# EAGLE design ble121lr_dongle_v21 (EAGLE 7.7.0)
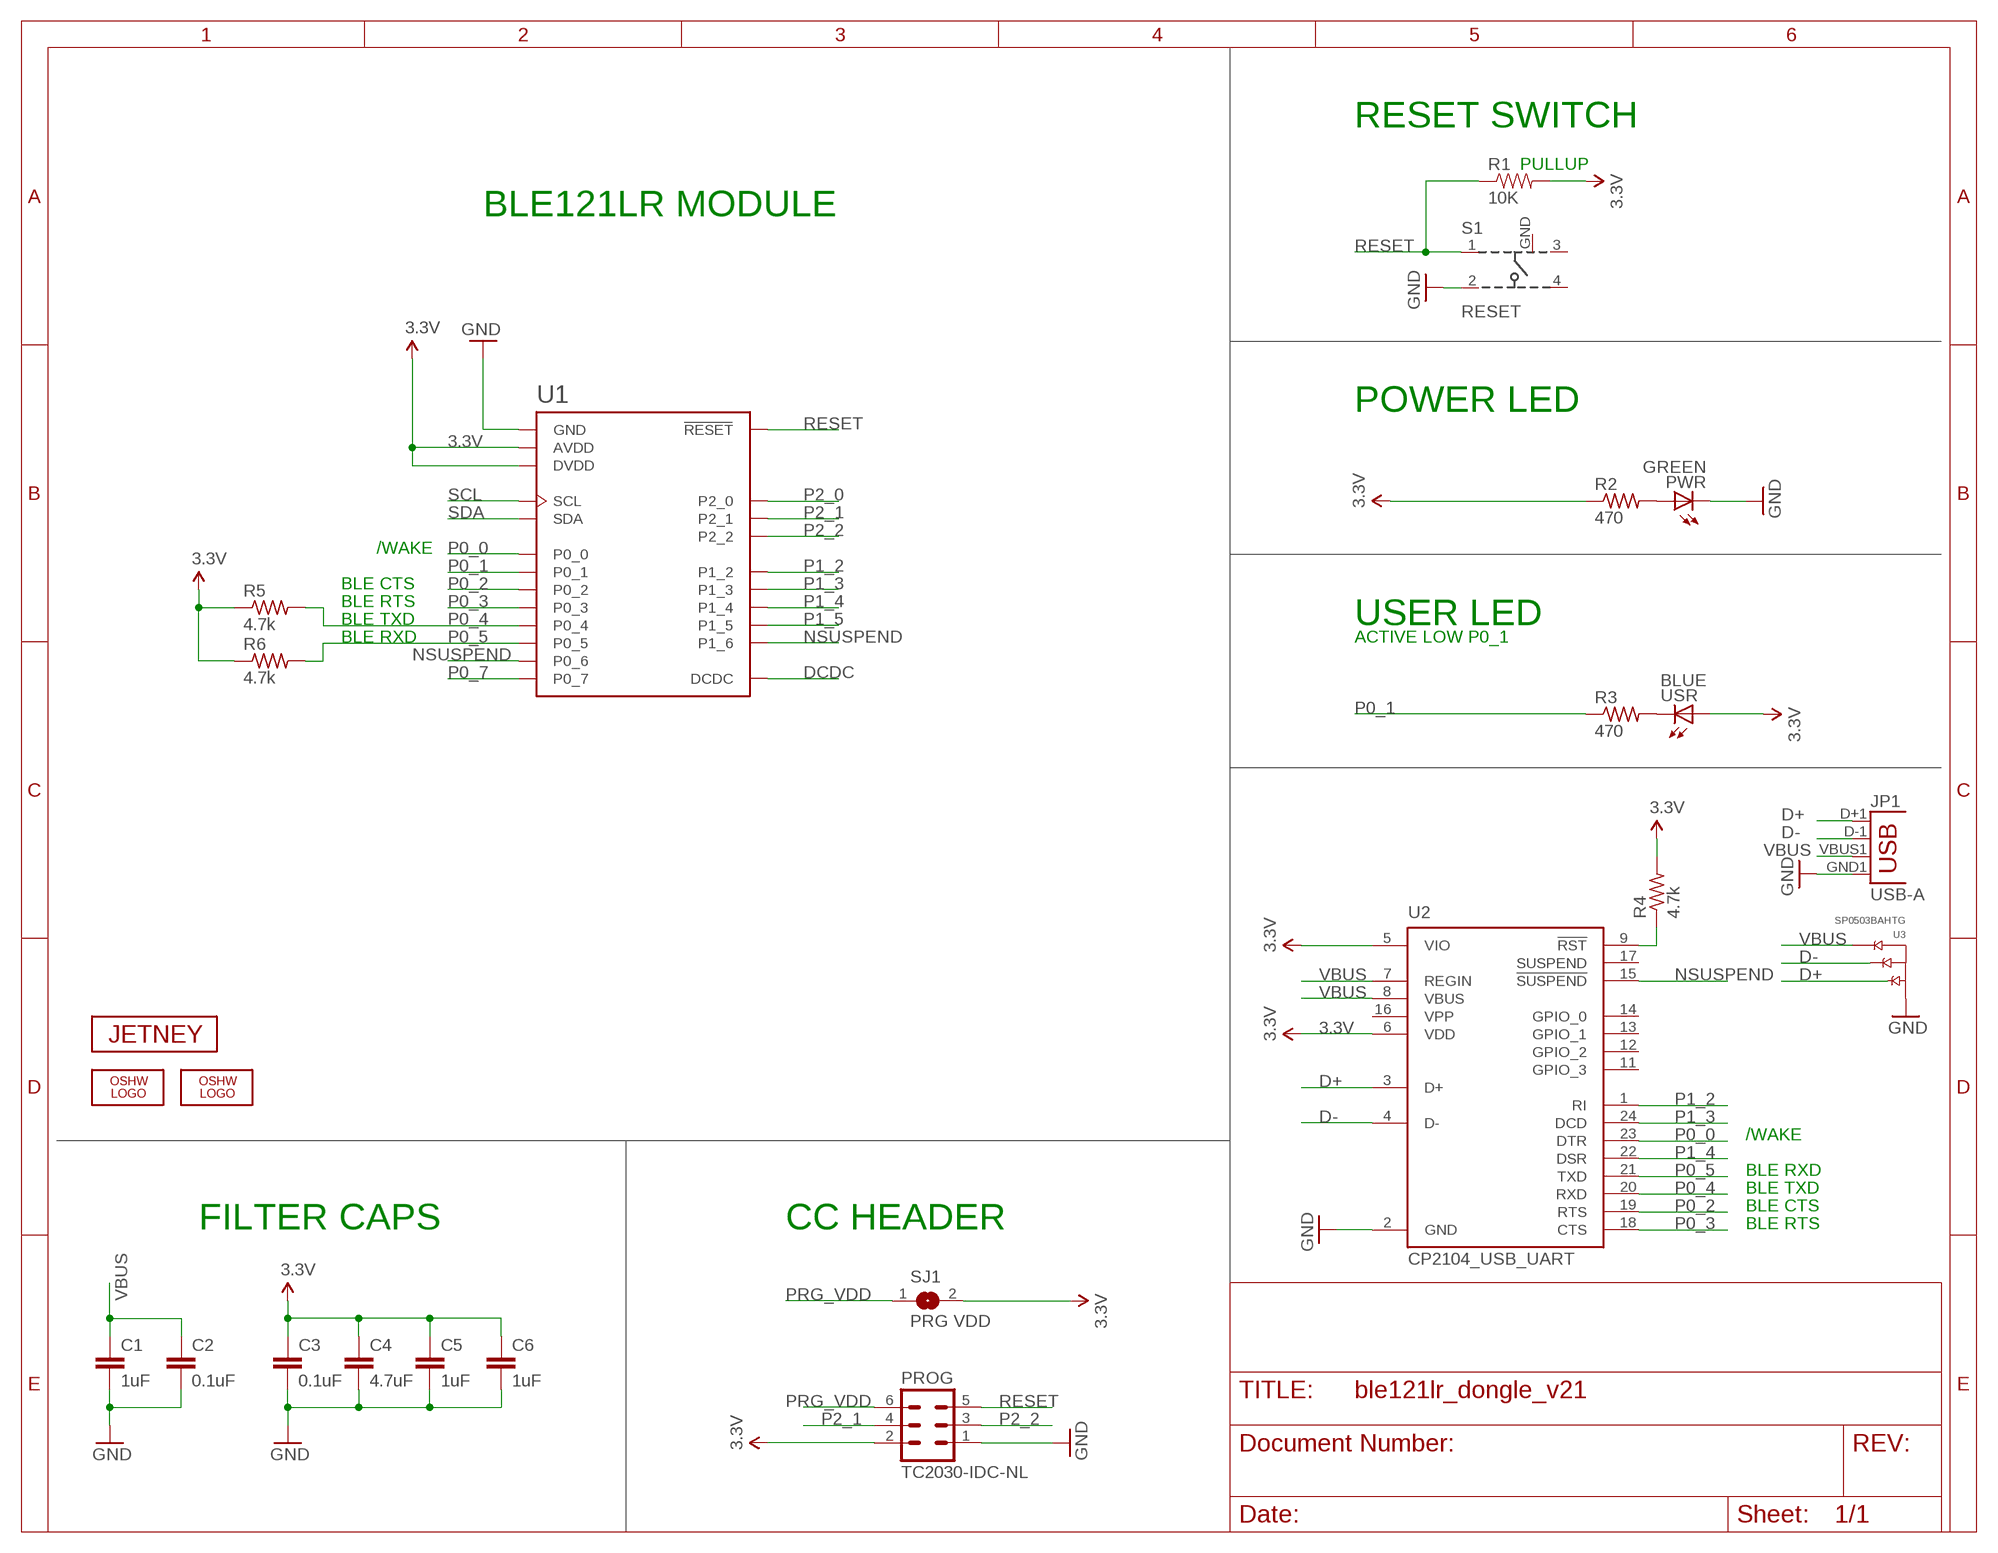
[diagram p0: schematic, sheet 1]

## Parts
C1  1uF  CAP0603-CAP  [0603-CAP]
C2  0.1uF  CAP0603-CAP  [0603-CAP]
C3  0.1uF  CAP0603-CAP  [0603-CAP]
C4  4.7uF  CAP0603-CAP  [0603-CAP]
C5  1uF  CAP0603-CAP  [0603-CAP]
C6  1uF  CAP0603-CAP  [0603-CAP]
JP1  USB-A  USBA-SMD-MALE-MOLEX  [USB-A-SMT-MALE-MOLEX]
LOGO1  OSHW_LOGO_FILLX0100-NT  [OSHW_FILLX100_NOTEXT]
LOGO2  OSHW_LOGO_FILLX0070-NT  [OSHW_FILLX70_NOTEXT]
PROG  TC2030-IDC-NL  [TC2030-IDC-NL]
PWR  GREEN  LEDCHIPLED_0805  [CHIPLED_0805]
R1  10K  RESISTOR0603-RES  [0603-RES]
R2  470  R-US_R0603  [R0603]
R3  470  R-US_R0603  [R0603]
R4  4.7k  R-US_R0603  [R0603]
R5  4.7k  R-US_R0603  [R0603]
R6  4.7k  R-US_R0603  [R0603]
S1  RESET  101-IG  [101-IG]
SJ1  PRG VDD  SJ  [SJ]
U1  BLE121LR-A  [BLE121LR-A]
U2  CP2104_USB_UART  [QFN-24_ALT1.PAC]
U3  SP0503BAHTG  [SOT143]
U$2  JETNEY-LOGO-12  [JETNEY-LOGO-12]
USR  BLUE  LEDCHIPLED_0805  [CHIPLED_0805]

## Nets
3.3V [power]: C3.1 C4.1 C5.1 C6.1 PROG.2 R1.2 R2.1 R4.2 R5.1 R6.1 SJ1.2 U1.AVDD U1.DVDD U2.5(VIO) U2.6(VDD) USR.A
D+: JP1.D+1(D+) U2.3(D+) U3.2(A)
D-: JP1.D-1(D-) U2.4(D-) U3.3(B)
DCDC: U1.DCDC
GND [power]: C1.2 C2.2 C3.2 C4.2 C5.2 C6.2 JP1.GND1(GND) PROG.1 PWR.C S1.2 U1.GND U1.GND@2(GND) U1.GND@3(GND) U1.GND@4(GND) U1.GND@5(GND) U1.GND@6(GND) U1.GND@7(GND) U1.GND@8(GND) U1.GND@9(GND) U1.GND@10(GND) U1.GND@11(GND) U1.GND@12(GND) U1.GND@13(GND) U2.2(GND) U3.1(GND)
N$1: PWR.A R2.2
N$4: R3.2 USR.C
N$6: R4.1 U2.9(!RST)
NSUSPEND: U1.P0_6 U1.P1_6 U2.15(!SUSPEND)
P0_0: U1.P0_0 U2.23(DTR)
P0_1: R3.1 U1.P0_1
P0_2: U1.P0_2 U2.19(RTS)
P0_3: U1.P0_3 U2.18(CTS)
P0_4: R5.2 U1.P0_4 U2.20(RXD)
P0_5: R6.2 U1.P0_5 U2.21(TXD)
P0_7: U1.P0_7
P1_2: U1.P1_2 U2.1(RI)
P1_3: U1.P1_3 U2.24(DCD)
P1_4: U1.P1_4 U2.22(DSR)
P1_5: U1.P1_5
P2_0: U1.P2_0
P2_1: PROG.4 U1.P2_1
P2_2: PROG.3 U1.P2_2
PRG_VDD [power]: PROG.6 SJ1.1
RESET: PROG.5 R1.1 S1.1 U1.RESET
SCL: U1.SCL
SDA: U1.SDA
VBUS: C1.1 C2.1 JP1.VBUS1(VBUS) U2.7(REGIN) U2.8(VBUS) U3.4(C)
Unconnected: S1.3 S1.4 U2.11(GPIO_3) U2.12(GPIO_2) U2.13(GPIO_1) U2.14(GPIO_0) U2.17(SUSPEND)

## Notes on the sheet
- RESET SWITCH
- PULLUP
- BLE121LR MODULE
- POWER LED
- /WAKE
- BLE CTS
- BLE RTS
- BLE TXD | USER LED
- BLE RXD | ACTIVE LOW P0_1
- /WAKE
- BLE RXD
- BLE TXD
- BLE CTS
- FILTER CAPS | CC HEADER | BLE RTS

## Power pins joined to a net without a drawn wire
GND: S1.GND
VPP: U2.16(VPP)

## Library data of the parts
C1-C6 = SparkFun:CAP: Capacitor Standard 0603 ceramic capacitor, and 0.1" leaded capacitor.
JP1 = SparkFun-Connectors:USB: USB Connectors USB-B-PTH is fully proven SKU : PRT-00139/CONN-08278 USB-miniB is fully proven SKU : PRT-00587 USB-A-PCB is untested. USB-A-H is throughly reviewed, but untested. Spark Fun Electronics SKU : PRT-00437 USB-B-SMT is throughly reviewed, but untested. Needs silkscreen touching up. USB-A-S has not been used/tested USB-MB-H has not been used/tested USB-MICROB has been used. CONN-09505
LOGO1 LOGO2 = oshw-logo:OSHW_LOGO_FILL
PROG = TagConnect:TC2030-IDC: Tag-Connect In Circuit Programming & Debug Cable 6 Pin http://www.tag-connect.com
PWR USR = led:LED: LED OSRAM: - CHIPLED LG R971, LG N971, LY N971, LG Q971, LY Q971, LO R971, LY R971 LH N974, LH R974 LS Q976, LO Q976, LY Q976 LO Q996 - Hyper CHIPLED LW Q18S LB Q993, LB Q99A, LB R99A - SideLED LS A670, LO A670, LY A670, LG A670, LP A670 LB A673, LV A673, LT A673, LW A673 LH A674 LY A675 LS A676, LA A676, LO A676, LY A676, LW A676 LS A679, LY A679, LG A679 - Hyper Micro SIDELED® LS Y876, LA Y876, LO Y876, LY Y876 LT Y87S - SmartLED LW L88C, LW L88S LB L89C, LB L89S, LG L890 LS L89K, LO L89K, LY L89K LS L896, LA L896, LO L896, LY L896 - TOPLED LS T670, LO T670, LY T670, LG T670, LP T670 LSG T670, LSP T670, LSY T670, LOP T670, LYG T670 LG T671, LOG T671, LSG T671 LB T673, LV T673, LT T673, LW T673 LH T674 LS T676, LA T676, LO T676, LY T676, LB T676, LH T676, LSB T676, LW T676 LB T67C, LV T67C, LT T67C, LS T67K, LO T67K, LY T67K, LW E67C LS E67B, LA E67B, LO E67B, LY E67B, LB E67C, LV E67C, LT E67C LW T67C LS T679, LY T679, LG T679 LS T770, LO T770, LY T770, LG T770, LP T770 LB T773, LV T773, LT T773, LW T773 LH T774 LS E675, LA E675, LY E675, LS T675 LS T776, LA T776, LO T776, LY T776, LB T776 LHGB T686 LT T68C, LB T68C - Hyper Mini TOPLED® LB M676 - Mini TOPLED Santana® LG M470 LS M47K, LO M47K, LY M47K Source: http://www.osram.convergy.de LUXEON: - LUMILED® LXK2-PW12-R00, LXK2-PW12-S00, LXK2-PW14-U00, LXK2-PW14-V00 LXK2-PM12-R00, LXK2-PM12-S00, LXK2-PM14-U00 LXK2-PE12-Q00, LXK2-PE12-R00, LXK2-PE12-S00, LXK2-PE14-T00, LXK2-PE14-U00 LXK2-PB12-K00, LXK2-PB12-L00, LXK2-PB12-M00, LXK2-PB14-N00, LXK2-PB14-P00, LXK2-PB14-Q00 LXK2-PR12-L00, LXK2-PR12-M00, LXK2-PR14-Q00, LXK2-PR14-R00 LXK2-PD12-Q00, LXK2-PD12-R00, LXK2-PD12-S00 LXK2-PH12-R00, LXK2-PH12-S00 LXK2-PL12-P00, LXK2-PL12-Q00, LXK2-PL12-R00 Source: www.luxeon.com KINGBRIGHT: KA-3528ASYC Source: www.kingbright.com
R1 = SparkFun:RESISTOR: Resistor Basic schematic elements and footprints for 0603, 1206, and PTH resistors.
R2-R6 = resistor:R-US_: RESISTOR, American symbol
S1 = sf-keyglove:101-IG
SJ1 = jumper:SJ: SMD solder JUMPER
U1 = sf-bluegiga:BLE121LR: Bluetooth Low Energy single-mode long-range module - Bluetooth 4.0 (CC2541). BLE121LR-A variant has an on-module ceramic chip antenna. BLE121LR-A variant includes keepout/restrict area. Antenna edge of the module should be flush up against the edge of the PCB. See datasheet for variant layout details. IT IS EXTREMELY IMPORTANT THAT YOU FOLLOW THE LAYOUT GUIDELINES FOR THIS MODULE IN ORDER TO ENSURE MAXIMUM RANGE. THIS MEANS THAT YOU NEED A SOLID GROUND PLANE EXTENDING AT LEAST 17 mm ON THE LEFT AND RIGHT SIDES OF THE MODULE, AS SHOWN IN THE DATASHEET. BLE121LR is a Bluetooth Smart Long Range module targeted for Bluetooth Smart applications where the best possible RF performance and range are required. At +8 dBm TX power and -98 dBm sensitivity BLE121LR has best-in-class RF performance and can provide Bluetooth Smart connectivity up to 450 meters. BLE121LR integrates all features required for a Bluetooth Smart application: Bluetooth radio, software stack and GATT based profiles. and it can also host end user applications, which means no external micro controller is required in size, price or power constrained devices. BLE121LR Bluetooth Smart module also has flexible hardware interfaces to connect to different peripherals or sensors. Although BLE121LR Bluetooth Smart Long Range Module is target for applications requiring high RF performance, it is still has relatively low power consumption and can be power using a standard 3V coin cell batteries. https://www.bluegiga.com/en-US/products/bluetooth-4.0-modules/ble121lr-bluetooth--smart-long https://github.com/jrowberg/sf-oshw Last updated 2014-08-02 by Jeff Rowberg <jeff@rowberg.net>; ANTENNA: On-module ceramic chip antenna
U2 = SparkFun-DigitalIC:CP2104_USB_UART
U3 = littlefuse:SP0503BAHTG
U$2 = sf-keyglove:JETNEY-LOGO

## Net classes
0 default: width 0.152 mm, drill 0.33 mm, clearance 0.152 mm
1 power: width 0.254 mm, drill 0.33 mm, clearance 0.152 mm

## Board
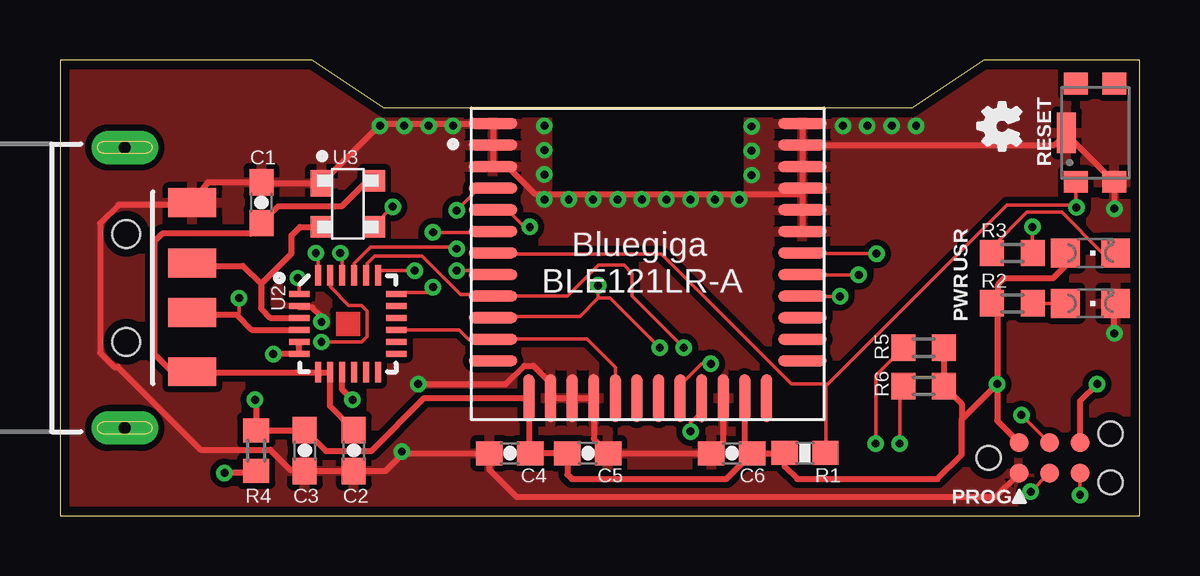
[diagram p1: board, top side]
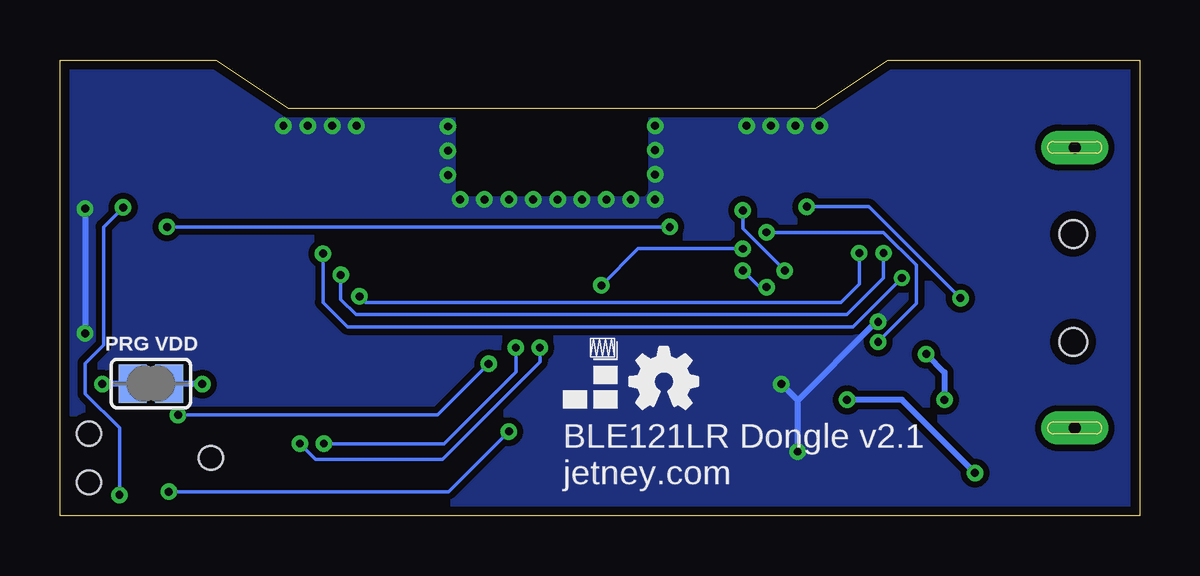
[diagram p2: board, bottom side, seen from below]

Size 45 x 19 mm. Coordinates in mm from the lower left corner, seen from the top.
Outline: 0,0 45,0 45,19 38.5,19 35.5,17 13.5,17 10.5,19 0,19 0,0
Copper layers (1*16): Top 0.0356mm / dielectric 1.5011mm / Bottom 0.0356mm
Design rules "default": minimum track width 6mil, minimum drill 13mil, track to track 6mil, track to pad 6mil, pad to pad 6mil, via to via 6mil, smd to smd 6mil, copper to edge 15mil, drill to drill 6mil, minimum pad ring 7mil, minimum via ring 7mil, stop-mask expansion 4mil, vias tented up to drill 13mil, thermal gap 10mil

### Footprints (pad centres in the part's own frame; a part is rotated, then mirrored left to right if it is on the bottom)
0603-CAP = smd 1.1 x 1: 1 -0.85,0; 2 0.85,0
USB-A-SMT-MALE-MOLEX = smd 1.2 x 2: D+1 1.027,-5.87; D-1 -1.027,-5.87; GND1 3.551,-5.87; VBUS1 -3.5,-5.87 | drill 0.5 pad 1.4 long: P$1 5.85,-3.05; P$3 -5.85,-3.05 | hole 1.15: 2.25,-3.12; -2.25,-3.12
TC2030-IDC-NL = smd 0.787 x 0.787: 1 -1.27,-0.635; 2 -1.27,0.635; 3 0,-0.635; 4 0,0.635; 5 1.27,-0.635; 6 1.27,0.635 | hole 0.991: -2.54,0; 2.54,1.016; 2.54,-1.016
CHIPLED_0805 = smd 1.2 x 1.2: A 0,-1.05; C 0,1.05
0603-RES = smd 1.1 x 1: 1 -0.85,0; 2 0.85,0
R0603 = smd 1 x 1.1: 1 -0.85,0; 2 0.85,0
101-IG = smd 0.9 x 1: 1 -2.05,0.8; 2 -2.05,-0.8; 3 2.05,0.8; 4 2.05,-0.8 | smd 1.7 x 0.8: GND 0,1.2
SJ = smd 1.168 x 1.6: 1 -0.762,0; 2 0.762,0
BLE121LR-A = smd 0.45 x 2: AVDD -4.95,-5.6; DCDC -0.45,-5.6; DVDD 4.05,-5.6; GND@4 -4.05,-5.6; GND@5 -3.15,-5.6; GND@6 -2.25,-5.6; GND@7 3.15,-5.6; P1_6 -1.35,-5.6; P2_0 0.45,-5.6; P2_1 1.35,-5.6; P2_2 2.25,-5.6; SCL 4.95,-5.6 | smd 2 x 0.45: GND -6.45,5.85; GND@2 -6.45,4.95; GND@3 -6.45,4.05; GND@8 6.45,1.35; GND@9 6.45,2.25; GND@10 6.45,3.15; GND@11 6.45,4.05; GND@12 6.45,4.95; GND@13 6.45,5.85; NC 6.45,-3.15; P0_0 -6.45,1.35; P0_1 -6.45,2.25; P0_2 -6.45,3.15; P0_3 -6.45,-0.45; P0_4 -6.45,-1.35; P0_5 -6.45,-2.25; P0_6 -6.45,-3.15; P0_7 -6.45,-4.05; P1_2 6.45,0.45; P1_3 6.45,-0.45; P1_4 6.45,-1.35; P1_5 6.45,-2.25; RESET -6.45,0.45; SDA 6.45,-4.05
QFN-24_ALT1.PAC = smd 0.851 x 0.25: 1 -2.025,1.25; 2 -2.025,0.75; 3 -2.025,0.25; 4 -2.025,-0.25; 5 -2.025,-0.75; 6 -2.025,-1.25; 13 2.025,-1.25; 14 2.025,-0.75; 15 2.025,-0.25; 16 2.025,0.25; 17 2.025,0.75; 18 2.025,1.25 | smd 0.25 x 0.851: 7 -1.25,-2.025; 8 -0.75,-2.025; 9 -0.25,-2.025; 10 0.25,-2.025; 11 0.75,-2.025; 12 1.25,-2.025; 19 1.25,2.025; 20 0.75,2.025; 21 0.25,2.025; 22 -0.25,2.025; 23 -0.75,2.025; 24 -1.25,2.025
SOT143 = smd 0.9 x 1.1: 1 -1.1,0.86 | smd 0.9 x 0.9: 2 -1.1,-0.96; 3 1.1,-0.96; 4 1.1,0.96

### Placement (x,y rotation side)
C1  8.4,13.05 90 top
C2  12.24,2.71 270 top
C3  10.21,2.71 270 top
C4  18.75,2.6 180 top
C5  22,2.6 0 top
C6  28,2.6 180 top
JP1  -0.35,9.5 90 top
LOGO1  21.24,4.46 0 bottom
LOGO2  40.04,15.24 90 top
PROG  41.25,2.4 0 top
PWR  42.95,8.85 270 top
R1  31.06,2.61 180 top
R2  39.7,8.85 0 top
R3  39.7,10.95 180 top
R4  8.18,2.71 90 top
R5  36,7 180 top
R6  36,5.4 180 top
S1  43.15,15.96 90 top
SJ1  41.21,5.5 0 bottom
U1  24.5,10.5 0 top
U2  12,8 0 top
U3  12,13 0 top
U$2  24.04,4.46 0 bottom
USR  42.95,10.95 270 top

### Tracks (layer width: path | path; a pad name or v marks a point on that pad's centre or on a via)
3.3V  (via drill 0.33)
  Top 0.254: C6.1 28.55,2.9 U1.DVDD | C6.1 27.77,1.52 21.34,1.52 21.15,1.71 C5.1 21.03,2.59 19.66,2.59 C4.1 19.55,2.6 U1.AVDD 15.19,4.9 12.98,2.69 11.08,2.69 C3.1 R4.2 8.18,4.78 v8.13,4.83 | v8.89,6.73 9.96,6.73 U2.6 U2.5 | C6.1 R1.2 30.21,2.05 30.73,1.52 36.58,1.52 37.59,2.54 37.59,4.01 | 39.71,3.3 PROG.2 39.06,3.95 v39.06,5.49 | R2.1 39.06,8.63 | 39.06,8.63 v39.06,5.49 | 37.59,4.01 v39.06,5.49 | 39.06,8.63 39.12,8.69 39.12,9.65 39.37,9.91 41.4,9.91 41.9,10.4 USR.A | R5.1 R6.1 37.59,4.66 37.59,4.01
  Bottom 0.254: v8.89,6.73 8.13,5.97 v8.13,4.83 | SJ1.2 39.08,5.5 v39.06,5.49
D+
  Top 0.254: JP1.D+1 5.38,10.41 7.62,10.41 8.38,9.65 | 8.38,9.65 8.38,8.64 8.77,8.25 U2.3 | 8.38,9.65 9.65,10.92 9.65,11.68 10.01,12.04 U3.2
D-  (via drill 0.33)
  Top 0.152: v13.87,12.88 13.11,12.12 U3.3 | v7.47,9.07 7.47,8.46 7.38,8.37
  Top 0.254: JP1.D-1 5.36,8.38 7.37,8.38 7.38,8.37 8,7.75 U2.4
  Bottom 0.152: v13.87,12.88 11.28,12.88 v7.47,9.07
GND  (via drill 0.33)
  Top 0.254: v43.95,7.6 43.95,8.8 PWR.C | U1.GND@7 27.65,3.1 C6.2 C5.2 22.25,3.2 U1.GND@6 U1.GND@5 U1.GND@4 20.34,4.95 20.34,5.64 19.74,6.25 19.36,6.25 18.59,5.49 v14.94,5.49 | v43.95,12.8 S1.2 41.95,15.91 S1.GND 41.44,15.45 U1.GND@12 | 14.31,2.6 13.56,1.85 C2.2 C3.2 10.13,1.91 9.6,1.91 8.76,2.74 5.87,2.74 2.41,6.2 2.26,6.2 1.68,6.78 1.68,12.19 2.44,12.95 5.18,12.95 JP1.GND1 6.17,13.9 C1.2 8.44,13.86 U3.1 13.39,16.35 U1.GND U1.GND@2 U1.GND@3 18.14,14.48 18.75,14.48 19.81,13.41 30.86,13.41 U1.GND@10 | 14.31,2.6 C4.2 17.9,1.91 19.05,0.76 38.98,0.76 PROG.1 | U1.GND@13 U1.GND@12 | U1.GND@12 U1.GND@11 U1.GND@10 | U1.GND@10 U1.GND@9 U1.GND@8 | v10.9,8.08 10.9,8.31 10.52,8.69 9.98,8.69 U2.2 | v14.25,2.67 14.31,2.6
  Bottom 0.254: v43.95,12.8 v43.95,7.6 | v10.9,8.08 11.05,7.92 11.12,7.92 14.25,4.8 | v14.25,2.67 14.25,4.8 | 14.25,4.8 v14.94,5.49
  other vias: 20.19,16.26 20.19,15.24 20.19,14.22 20.19,13.18 21.21,13.18 22.23,13.18 23.24,13.18 24.26,13.18 25.27,13.18 26.29,13.18 27.3,13.18 28.32,13.18 28.83,14.2 28.83,15.21 28.83,16.23 32.64,16.26 33.66,16.26 34.67,16.26 35.69,16.26 16.38,16.26 15.37,16.26 14.35,16.26 13.34,16.26
  pour Bottom (isolate 0.254): 0,0 45,0 45,19 0,19
  pour Top (isolate 0.254): 0,0 45,0 45,19 0,19
N$1
  Top 0.152: R2.2 PWR.A
N$4
  Top 0.152: R3.2 38.86,10.97 38.86,11.2 40.31,12.65 41.76,12.65 43.43,10.97 43.97,10.97 USR.C
N$6  (via drill 0.33)
  Top 0.254: R4.1 8.1,1.78 v6.86,1.78 | v12.19,4.83 11.75,5.27 U2.9
  Bottom 0.254: v6.86,1.78 9.91,4.83 v12.19,4.83
NSUSPEND
  Top 0.152: U2.15 16.64,7.75 17.03,7.35 U1.P0_6 18.07,7.37 21.97,7.37 23.15,6.19 U1.P1_6
P0_0  (via drill 0.33)
  Top 0.152: v10.9,7.24 12.57,7.24 12.8,7.47 12.8,8.53 12.57,8.76 12.04,8.76 11.28,9.53 11.28,9.98 U2.23 | v15.54,11.81 17.98,11.81 U1.P0_0
  Bottom 0.152: v10.9,7.24 9.3,8.84 9.3,10.44 10.67,11.81 v15.54,11.81
P0_1  (via drill 0.33)
  Top 0.152: v40.54,12.04 40.54,10.97 R3.1 | v19.58,12.04 19.36,12.04 18.67,12.72 18.06,12.72 U1.P0_1
  Bottom 0.152: v19.58,12.04 v40.54,12.04
P0_2  (via drill 0.33)
  Top 0.152: U1.P0_2 17.98,13.64 17.45,13.64 v16.54,12.72 | 13.25,10.2 U2.19 13.26,10.21 v14.78,10.21
  Bottom 0.152: v14.78,10.21 16.54,11.96 v16.54,12.72
P0_3  (via drill 0.33)
  Top 0.152: v15.54,9.53 15.32,9.3 14.1,9.3 U2.18 | v16.54,10.21 17.83,10.21 17.98,10.06 U1.P0_3
  Bottom 0.152: v15.54,9.53 15.85,9.53 v16.54,10.21
P0_4  (via drill 0.33)
  Top 0.152: U2.20 12.8,10.06 12.8,10.52 13.11,10.82 15.09,10.82 16.69,9.22 17.98,9.22 U1.P0_4 21.15,9.15 22.45,10.45 23.5,10.45 23.85,10.1 23.85,9.15 v26,7 | v34,3 34,5.85 R5.2
  Bottom 0.152: v26,7 26,6 29,3 v34,3
P0_5  (via drill 0.33)
  Top 0.152: v16.54,11.12 16.46,11.2 12.95,11.2 12.27,10.52 12.27,10.06 U2.21 | 22.43,9.07 v22.43,9.6 | 22.43,9.07 21.67,8.31 18.06,8.31 U1.P0_5 | 22.43,9.07 22.93,9.07 v25,7 | v35,3 35,5.25 R6.2
  Bottom 0.152: v16.54,11.12 20.91,11.12 v22.43,9.6 | v25,7 25,6.4 29.05,2.35 34.35,2.35 v35,3
P1_2  (via drill 0.33)
  Top 0.152: U1.P1_2 30.98,10.92 v34.04,10.92 | v9.91,9.91 9.97,9.84 U2.1
  Bottom 0.152: v34.04,10.92 34.04,8.89 33.02,7.87 11.94,7.87 v9.91,9.91
P1_3  (via drill 0.33)
  Top 0.152: U1.P1_3 30.97,10.03 v33.3,10.03 | v10.67,10.95 10.75,10.87 U2.24
  Bottom 0.152: v33.3,10.03 33.3,9.02 32.66,8.38 12.19,8.38 10.67,9.91 v10.67,10.95
P1_4  (via drill 0.33)
  Top 0.152: U1.P1_4 v32.51,9.14 | v11.68,10.95 11.75,10.88 U2.22
  Bottom 0.152: v32.51,9.14 32.26,8.89 12.45,8.89 11.68,9.65 v11.68,10.95
P2_1  (via drill 0.33)
  Top 0.152: v40.08,4.19 41.22,3.05 PROG.4 | v27.13,6.33 26.75,6.33 25.91,5.49 25.91,4.95 U1.P2_1
  Bottom 0.152: v40.08,4.19 29.26,4.19 v27.13,6.33
P2_2  (via drill 0.33)
  Top 0.152: v40.46,0.99 41.22,1.75 PROG.3 | v26.29,3.5 26.29,3.89 26.75,4.34 26.75,4.88 U1.P2_2
  Bottom 0.152: v40.46,0.99 28.8,0.99 v26.29,3.5
PRG_VDD  (via drill 0.33)
  Top 0.254: v43.23,5.49 42.52,4.78 PROG.6
  Bottom 0.254: SJ1.1 41.99,5.49 v43.23,5.49
RESET  (via drill 0.33)
  Top 0.152: S1.1 42.35,12.87 v42.37,12.85 42.29,12.95 39.47,12.95 31.97,5.45 | v42.52,0.86 | v42.52,0.86 PROG.5 | 31.97,5.45 31.93,5.41 31.93,2.67 R1.1 | U1.RESET 18.06,10.9 25.07,10.9 30.48,5.49 31.93,5.49 31.97,5.45
  Bottom 0.152: v42.37,12.85 43.18,12.04 43.18,7.11 43.94,6.35 43.94,5.08 42.52,3.66 v42.52,0.86
VBUS
  Top 0.254: C2.1 11.25,4.55 U2.8 U2.7 5.29,5.97 JP1.VBUS1 4.67,6 3.94,6.73 3.94,11.43 4.27,11.76 7.96,11.76 C1.1 9.1,12.9 11.76,12.9 12.82,13.96 U3.4

### Text on the board
tPlace: RESET | Bluegiga | BLE121LR-A
bPlace: PRG VDD | BLE121LR Dongle v2.1 | jetney.com